# EAGLE design Rev1 (EAGLE 6.5.0)
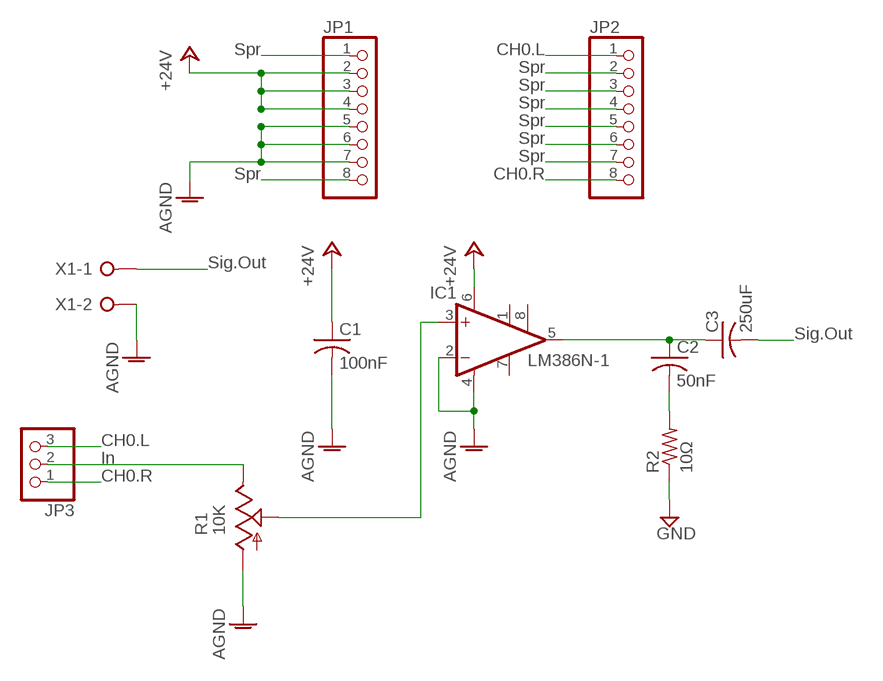
[diagram p0: schematic, sheet 1]

## Parts
C1  100nF  C-US075-032X103  [C075-032X103]
C2  50nF  C-US075-032X103  [C075-032X103]
C3  250uF  C-US025-050X050  [C025-050X050]
IC1  LM386N-1  [DIL08]
JP1  PINHD-1X8  [1X08]
JP2  PINHD-1X8  [1X08]
JP3  PINHD-1X3  [1X03]
R1  10K  TRIM_US-PT-10S  [PT-10S]
R2  10Ω  R-US_0204/7  [0204/7]
X1  W237-02P  [W237-132]

## Nets
+24V: C1.1 IC1.6(VS) JP1.2 JP1.3 JP1.4
AGND: C1.2 IC1.2(-IN) IC1.4(GND) JP1.5 JP1.6 JP1.7 R1.A X1.2
CH0.L: JP2.1 JP3.3
CH0.R: JP2.8 JP3.1
GND: R2.1
JP1-P1: JP1.1
JP1-P2: JP1.8
JP2-P2: JP2.2
JP2-P3: JP2.3
JP2-P4: JP2.4
JP2-P5: JP2.5
JP2-P6: JP2.6
JP2-P7: JP2.7
N$1: C2.1 C3.1 IC1.5(OUT)
N$5: IC1.3(+IN) R1.S
N$7: JP3.2 R1.E
N$10: C2.2 R2.2
SIGOUT: C3.2 X1.1
Unconnected: IC1.1(GAIN) IC1.7(BYPASS) IC1.8(GAIN)

## Notes on the sheet
- Spr | CH0.L
- Spr
- Spr
- Spr
- Spr
- Spr
- Spr
- Spr | CH0.R
- Sig.Out
- Sig.Out
- CH0.L
- In
- CH0.R

## Library data of the parts
C1-C3 = resistor:C-US: CAPACITOR, American symbol
IC1 = linear:LM386?-*: Low Voltage Audio Power Amplifier Source: http://cache.national.com/ds/LM/LM386.pdf
JP1 JP2 = pinhead+:PINHD-1X8: PIN HEADER
JP3 = pinhead:PINHD-1X3: PIN HEADER
R1 = pot:TRIM_US-: POTENTIOMETER
R2 = rcl:R-US_: RESISTOR, American symbol
X1 = con-wago-508:W237-02P: WAGO SREW CLAMP; OC_FARNELL: unknown; OC_NEWARK: unknown

## Board
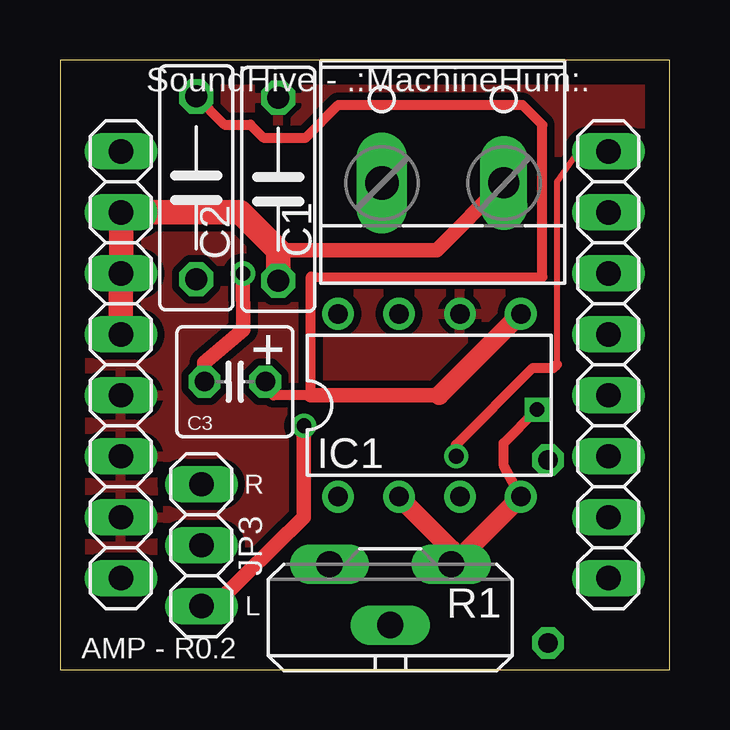
[diagram p1: board, top side]
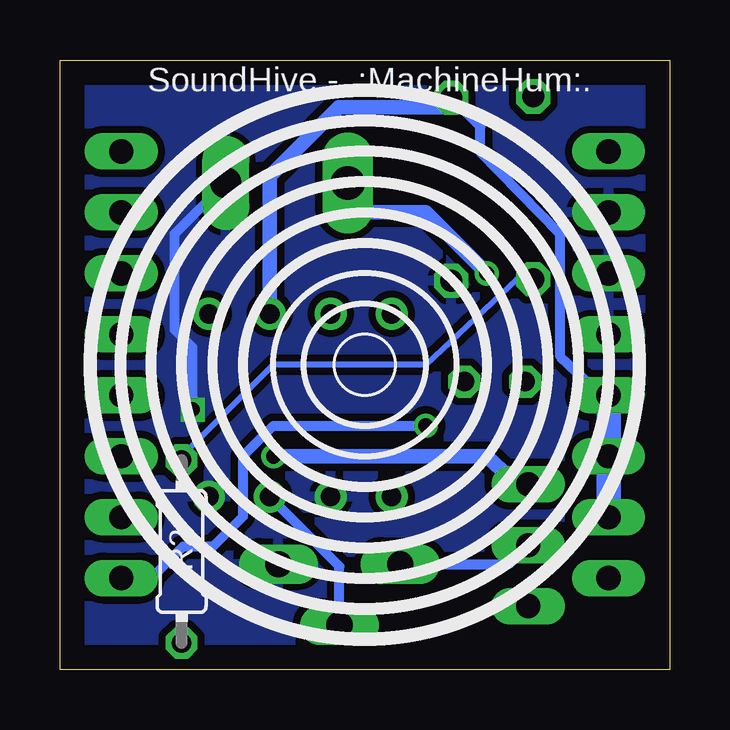
[diagram p2: board, bottom side, seen from below]

Size 25.4 x 25.4 mm. Coordinates in mm from the lower left corner, seen from the top.
Outline: 0,0 25.4,0 25.4,25.4 0,25.4 0,0
Copper layers (1*16): Top 0.035mm / dielectric 1.5mm / Bottom 0.035mm
Design rules "default": minimum track width 10mil, minimum drill 24mil, track to track 8mil, track to pad 8mil, pad to pad 8mil, via to via 8mil, smd to smd 8mil, copper to edge 40mil, drill to drill 8mil, minimum pad ring 10mil, minimum via ring 8mil, stop-mask expansion 4mil, vias tented up to drill 0mil, thermal gap 10mil

### Footprints (pad centres in the part's own frame; a part is rotated, then mirrored left to right if it is on the bottom)
C075-032X103 = drill 0.914 octagon: 1 -3.81,0; 2 3.81,0
C025-050X050 = drill 0.813 octagon: 1 -1.27,0; 2 1.27,0
DIL08 = drill 0.813 pad 1.27: 1 -3.81,-3.81; 2 -1.27,-3.81; 3 1.27,-3.81; 4 3.81,-3.81; 5 3.81,3.81; 6 1.27,3.81; 7 -1.27,3.81; 8 -3.81,3.81
1X08 = drill 1.016 long: 1 -8.89,0; 2 -6.35,0; 3 -3.81,0; 4 -1.27,0; 5 1.27,0; 6 3.81,0; 7 6.35,0; 8 8.89,0
1X03 = drill 1.016 long: 1 -2.54,0; 2 0,0; 3 2.54,0
PT-10S = drill 1.1 long: A -2.54,-1.27; E 2.54,-1.27; S 0,1.27
0204/7 = drill 0.813 octagon: 1 -3.81,0; 2 3.81,0
W237-132 = drill 1.4 long: 1 -2.54,-0.635 | drill 1.3 long: 2 2.54,-0.635

### Placement (x,y rotation side)
C1  9.09,20.01 270 top
C2  5.68,20.07 270 top
C3  7.28,12 180 top
IC1  15.39,11.02 0 top
JP1  2.54,12.7 90 top
JP2  22.85,12.7 90 top
JP3  5.89,5.18 270 top
R1  13.76,3.12 180 top
R2  20.33,4.92 90 bottom
X1  15.95,20.92 0 top

### Tracks (layer width: path | path; a pad name or v marks a point on that pad's centre or on a via)
+24V
  Bottom 0.406: 9.48,23.43 C1.1 7.88,22.61 7.88,21.56 4.55,18.14 4.55,13.04 2.85,11.43 JP1.4
  Bottom 0.61: IC1.6 16.66,20.57 13.8,23.43 9.48,23.43
  Bottom 1.016: JP1.2 JP1.3 JP1.4
  pour Top (isolate 0.305): 0,0 0,25.4 25.4,25.4 25.4,0
AGND  (via drill 0.6)
  Top 0.406: IC1.4 18.5,8.49 18.48,9.43 18.48,9.44 v19.88,10.83 | JP1.7 | JP1.6 | R1.A 16.39,4.39
  Top 0.61: 9.09,17.48 15.69,17.48 X1.2
  Top 0.813: 16.39,4.39 IC1.4 | R1.A 16.3,5.02 IC1.2
  Top 1.016: C1.2 9.09,17.48 7.51,19.05 JP1.7 JP1.6 | JP1.6 JP1.5
  Bottom 0.406: v19.88,10.83 19.88,13.41 20.62,14.16 20.62,18.15 X1.2
  pour Bottom (isolate 0.305): 0,0 0,25.4 25.4,25.4 25.4,0
CH0.L  (via drill 0.61)
  Top 0.61: v10.16,10.16 10.16,6.35 6.38,2.64 JP3.3
  Bottom 0.406: v10.16,10.16 16.51,10.16 17.78,8.89 17.78,6.38 19.04,5.12 20.28,5.12 20.32,5.08 21.59,3.81 JP2.1
CH0.R  (via drill 0.61)
  Top 0.254: 20.7,12.71 20.7,20.33 21.59,21.59 JP2.8
  Top 0.406: v16.51,8.89 16.51,9.38 19.7,12.57 20.56,12.57 20.7,12.71
  Bottom 0.61: v16.51,8.89 7.62,8.89 6.37,7.72 JP3.1
N$1
  Top 0.406: C3.1 8.89,11.43 10.46,11.43 10.46,16.37 20.1,16.35 20.1,22.7 19.27,23.53 11.6,23.53 10.24,22.17 8.47,22.17 7.93,22.71 6.85,22.71 C2.1
  Top 0.61: 10.46,11.43 15.8,11.43
  Top 0.813: 15.8,11.43 IC1.5
N$5
  Bottom 0.406: R1.S 13.76,4.31 IC1.3
N$7
  Bottom 0.406: R1.E 6.68,4.39 JP3.2
N$10
  Bottom 0.254: 20.32,8.89 16.51,12.7 10.16,12.7 6.37,16.26 C2.2
  Bottom 0.406: 20.32,8.89 20.32,8.74 R2.2
SIGOUT  (via drill 0.61)
  Top 0.61: v7.62,16.51 7.62,14.16 6.02,12.78 C3.2
  Bottom 0.61: v7.62,16.51 10.16,19.05 12.7,19.05 X1.1

### Text on the board
tPlace: SoundHive - .:MachineHum:. | + | R | L | AMP - R0.2
bPlace: SoundHive - .:MachineHum:.